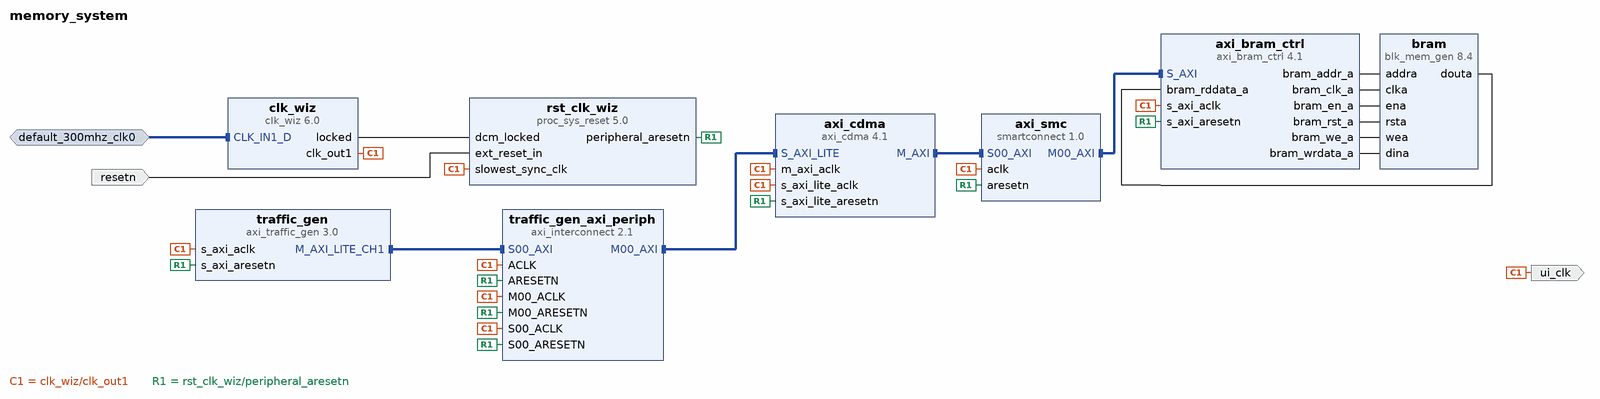
[diagram p0: block diagram of the top level]
# Vivado block design memory_system, xcu250-figd2104-2L-e, Vivado 2024.1
create_bd_design memory_system

create_bd_intf_port -mode Slave -vlnv xilinx.com:interface:diff_clock_rtl:1.0 default_300mhz_clk0
set_property -dict {CONFIG.FREQ_HZ 300000000} [get_bd_intf_ports default_300mhz_clk0]
create_bd_port -dir I -type rst resetn
set_property -dict {CONFIG.POLARITY ACTIVE_LOW} [get_bd_ports resetn]
create_bd_port -dir O -type clk ui_clk

create_bd_cell -type ip -vlnv xilinx.com:ip:axi_traffic_gen:3.0 traffic_gen
set_property -dict [list \
  CONFIG.C_ATG_MODE AXI4-Lite \
  CONFIG.C_ATG_SYSTEM_CMD_MAX_RETRY 3 \
  CONFIG.C_ATG_SYSTEM_INIT_ADDR_MIF ../../../../../../../memory_system.srcs/atg_addr.coe \
  CONFIG.C_ATG_SYSTEM_INIT_DATA_MIF ../../../../../../../memory_system.srcs/atg_data.coe \
  CONFIG.C_ATG_SYSTEM_TEST_MAX_CLKS 4294967295 \
] [get_bd_cells traffic_gen]
create_bd_cell -type ip -vlnv xilinx.com:ip:axi_cdma:4.1 axi_cdma
set_property -dict [list \
  CONFIG.C_ADDR_WIDTH 34 \
  CONFIG.C_INCLUDE_SG 0 \
  CONFIG.C_M_AXI_DATA_WIDTH 512 \
  CONFIG.C_M_AXI_MAX_BURST_LEN 32 \
] [get_bd_cells axi_cdma]
create_bd_cell -type ip -vlnv xilinx.com:ip:blk_mem_gen:8.4 bram
set_property -dict [list \
  CONFIG.Coe_File ../../../../../../../memory_system.srcs/ram_init.coe \
  CONFIG.EN_SAFETY_CKT false \
  CONFIG.Enable_32bit_Address true \
  CONFIG.Fill_Remaining_Memory_Locations true \
  CONFIG.Load_Init_File true \
  CONFIG.Remaining_Memory_Locations deadbeef \
  CONFIG.Write_Depth_A 64 \
  CONFIG.Write_Width_A 1024 \
  CONFIG.use_bram_block Stand_Alone \
] [get_bd_cells bram]
create_bd_cell -type ip -vlnv xilinx.com:ip:axi_bram_ctrl:4.1 axi_bram_ctrl
set_property -dict {CONFIG.DATA_WIDTH 1024 CONFIG.READ_LATENCY 2 CONFIG.SINGLE_PORT_BRAM 1} [get_bd_cells axi_bram_ctrl]
create_bd_cell -type ip -vlnv xilinx.com:ip:smartconnect:1.0 axi_smc
set_property -dict {CONFIG.NUM_SI 1} [get_bd_cells axi_smc]
create_bd_cell -type ip -vlnv xilinx.com:ip:clk_wiz:6.0 clk_wiz
set_property -dict [list \
  CONFIG.CLKIN1_JITTER_PS 33.330000000000005 \
  CONFIG.CLKOUT1_JITTER 81.814 \
  CONFIG.CLKOUT1_PHASE_ERROR 77.836 \
  CONFIG.CLKOUT1_REQUESTED_OUT_FREQ 300.000 \
  CONFIG.CLK_IN1_BOARD_INTERFACE default_300mhz_clk0 \
  CONFIG.MMCM_CLKFBOUT_MULT_F 4.000 \
  CONFIG.MMCM_CLKIN1_PERIOD 3.333 \
  CONFIG.MMCM_CLKIN2_PERIOD 10.0 \
  CONFIG.MMCM_CLKOUT0_DIVIDE_F 4.000 \
  CONFIG.PRIM_SOURCE Differential_clock_capable_pin \
  CONFIG.RESET_BOARD_INTERFACE resetn \
  CONFIG.RESET_PORT reset \
  CONFIG.RESET_TYPE ACTIVE_HIGH \
  CONFIG.USE_BOARD_FLOW true \
  CONFIG.USE_INCLK_STOPPED false \
  CONFIG.USE_POWER_DOWN false \
  CONFIG.USE_RESET false \
] [get_bd_cells clk_wiz]
create_bd_cell -type ip -vlnv xilinx.com:ip:proc_sys_reset:5.0 rst_clk_wiz
set_property -dict {CONFIG.RESET_BOARD_INTERFACE resetn CONFIG.USE_BOARD_FLOW true} [get_bd_cells rst_clk_wiz]
create_bd_cell -type ip -vlnv xilinx.com:ip:axi_interconnect:2.1 traffic_gen_axi_periph
set_property -dict {CONFIG.NUM_MI 1} [get_bd_cells traffic_gen_axi_periph]

# ---- connections ----

connect_bd_intf_net -intf_net axi_cdma_0_M_AXI [get_bd_intf_pins axi_cdma/M_AXI] [get_bd_intf_pins axi_smc/S00_AXI]
connect_bd_intf_net [get_bd_intf_pins axi_smc/M00_AXI] [get_bd_intf_pins axi_bram_ctrl/S_AXI]
connect_bd_intf_net -intf_net axi_traffic_gen_0_M_AXI_LITE_CH1 [get_bd_intf_pins traffic_gen/M_AXI_LITE_CH1] [get_bd_intf_pins traffic_gen_axi_periph/S00_AXI]
connect_bd_intf_net [get_bd_intf_pins traffic_gen_axi_periph/M00_AXI] [get_bd_intf_pins axi_cdma/S_AXI_LITE]
connect_bd_intf_net -intf_net default_300mhz_clk0_1 [get_bd_intf_ports default_300mhz_clk0] [get_bd_intf_pins clk_wiz/CLK_IN1_D]
connect_bd_net [get_bd_pins axi_bram_ctrl/bram_addr_a] [get_bd_pins bram/addra]
connect_bd_net [get_bd_pins axi_bram_ctrl/bram_clk_a] [get_bd_pins bram/clka]
connect_bd_net [get_bd_pins axi_bram_ctrl/bram_en_a] [get_bd_pins bram/ena]
connect_bd_net [get_bd_pins axi_bram_ctrl/bram_rst_a] [get_bd_pins bram/rsta]
connect_bd_net [get_bd_pins axi_bram_ctrl/bram_we_a] [get_bd_pins bram/wea]
connect_bd_net [get_bd_pins axi_bram_ctrl/bram_wrdata_a] [get_bd_pins bram/dina]
connect_bd_net [get_bd_pins bram/douta] [get_bd_pins axi_bram_ctrl/bram_rddata_a]
connect_bd_net [get_bd_pins clk_wiz/clk_out1] \
  [get_bd_ports ui_clk] [get_bd_pins axi_cdma/m_axi_aclk] [get_bd_pins axi_smc/aclk] [get_bd_pins axi_bram_ctrl/s_axi_aclk] \
  [get_bd_pins rst_clk_wiz/slowest_sync_clk] [get_bd_pins traffic_gen/s_axi_aclk] \
  [get_bd_pins traffic_gen_axi_periph/S00_ACLK] [get_bd_pins axi_cdma/s_axi_lite_aclk] \
  [get_bd_pins traffic_gen_axi_periph/M00_ACLK] [get_bd_pins traffic_gen_axi_periph/ACLK]
connect_bd_net [get_bd_pins clk_wiz/locked] [get_bd_pins rst_clk_wiz/dcm_locked]
connect_bd_net [get_bd_ports resetn] [get_bd_pins rst_clk_wiz/ext_reset_in]
connect_bd_net -net rst_clk_wiz_100M_peripheral_aresetn [get_bd_pins rst_clk_wiz/peripheral_aresetn] \
  [get_bd_pins axi_bram_ctrl/s_axi_aresetn] [get_bd_pins axi_smc/aresetn] [get_bd_pins traffic_gen/s_axi_aresetn] \
  [get_bd_pins traffic_gen_axi_periph/S00_ARESETN] [get_bd_pins axi_cdma/s_axi_lite_aresetn] \
  [get_bd_pins traffic_gen_axi_periph/M00_ARESETN] [get_bd_pins traffic_gen_axi_periph/ARESETN]

# ---- address map ----
assign_bd_address -offset 0x0C0000000 -range 8K -target_address_space [get_bd_addr_spaces axi_cdma/Data] [get_bd_addr_segs axi_bram_ctrl/S_AXI/Mem0]
assign_bd_address -offset 0x44A00000 -range 64K -target_address_space [get_bd_addr_spaces traffic_gen/Reg1] [get_bd_addr_segs axi_cdma/S_AXI_LITE/Reg]

validate_bd_design
save_bd_design
